# Altium schematic sheet Top.SchDoc: ESCBackerBoard_TOP
size Letter; Author: William Peyton; Organization: Colorado School of Mines; Address1: 1500 Illinois St.; Address2: Golden; Address3: CO 80401; Address4: USA; DocumentNumber: 0000; Revision: V1.0; SheetNumber: 1; SheetTotal: 2
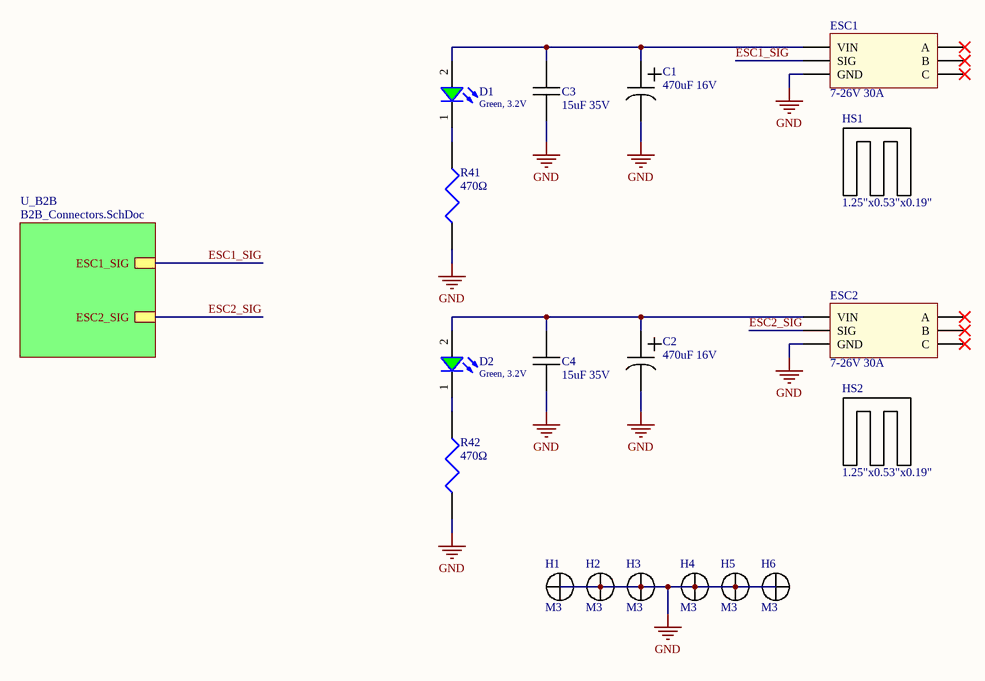
[diagram p0: Top.SchDoc]

## Parts
C1  470uF 16V  [875115357006]
C2  470uF 16V  [875115357006]
C3  15uF 35V  [C2012M Generic]
C4  15uF 35V  [C2012M Generic]
D1  Green, 3.2V  [WL-SMCW_1206]
D2  Green, 3.2V  [WL-SMCW_1206]
ESC1  7-26V 30A  [BasicESC]
ESC2  7-26V 30A  [BasicESC]
H1  M3  [M3_MOUNTING_HOLE]
H2  M3  [M3_MOUNTING_HOLE]
H3  M3  [M3_MOUNTING_HOLE]
H4  M3  [M3_MOUNTING_HOLE]
H5  M3  [M3_MOUNTING_HOLE]
H6  M3  [M3_MOUNTING_HOLE]
HS1  1.25"x0.53"x0.19"  [508500B00000G]
HS2  1.25"x0.53"x0.19"  [508500B00000G]
R41  470Ω  [RMCF1206]
R42  470Ω  [RMCF1206]

## Sub-sheets
U_B2B = B2B_Connectors.SchDoc: ESC2_SIG, ESC1_SIG

## Nets
GND: C1.2 C2.2 C3.2 C4.2 ESC1.GND ESC2.GND H1.1 H2.1 H3.1 H4.1 H5.1 H6.1 R41.1 R42.1
ESC1_SIG: ESC1.SIG ; sheet U_B2B/ESC1_SIG
ESC2_SIG: ESC2.SIG ; sheet U_B2B/ESC2_SIG
NetC1_1: C1.1 C3.1 D1.2(A) ESC1.VIN
NetC2_1: C2.1 C4.1 D2.2(A) ESC2.VIN
NetD1_1: D1.1(K) R41.2
NetD2_1: D2.1(K) R42.2

Not connected (* = marked no-connect by the designer): ESC1 A* B* C*; ESC2 A* B* C*

## Notes on the sheet
- Title
- Size:
- Date:
- Letter
- Number:
- Time:
- Revision:
- Sheet
- of
- File:

## Library data of the parts
C1 C2 = 875115357006: Wurth CAP ALUM POLY 470UF 20% 16V SMD; Manufacturer: Würth Elektronik; ComponentLink1Description: DigiKey; ComponentLink1URL: https://www.digikey.com/en/products/detail/w%C3%BCrth-elektronik/875115357006/5147625?s=N4IgTCBcDaIBwHYCsBGFSDMSEAYcDYQBdAXyA; Part Number: 875115357006; Value: 470uF 16V
C3 C4 = C2012X5R1V156M125AC: TDK CAP CER 15UF 35V X5R 0805; Manufacturer: TDK Corporation; Part Number: C2012X5R1V156M125AC; Value: 15uF 35V; ComponentLink1Description: New link; ComponentLink1URL: *
D1 D2 = 150120GS75000: WL-SMCW SMT Mono-color Chip LED Waterclear, size 1206, Green, 3.2V, 140deg; Chip Technology: InGaN; Dominant Wavelength typ.: 525nm; Luminous Intensity typ.: 450mcd; Peak Wavelength typ.: 515nm; Viewing Angle: 140deg; ComponentLink1Description: Manufacturer; ComponentLink1URL: http://www.we-online.de; ComponentLink2URL: https://www.we-online.com/catalog/datasheet/150120GS75000.pdf; ComponentLink2Description: Datasheet; Forward Voltage typ.: 3.2V; Emitting Color: Green; Mounting Technology: SMT; Operating Temperature: -40 to +85degC; Published Date: December 2019; Part Number: 150120GS75000; Packaging: Tape and Reel; Size: 1206; Publisher: Wurth Elektronik
ESC1 ESC2 = BasicESC: Blue Robotics BasicESC; Manufacturer: Blue Robotics; Part Number: *; Value: 7-26V 30A; ComponentLink1Description: Blue Robotics; ComponentLink1URL: https://bluerobotics.com/store/thrusters/speed-controllers/besc30-r3/
H1-H6 = M3_Mounting_Hole: MECHANICAL M3 Mounting Hole
HS1 HS2 = 508500B00000G: AAVID HEATSINK 24-PIN DIP GLUE-ON BLK; Manufacturer: Aavid, Thermal Division of Boyd Corporation; Part Number: 508500B00000G; Value: 1.25"x0.53"x0.19"; ComponentLink1Description: DigiKey; ComponentLink1URL: https://www.digikey.com/en/products/detail/aavid-thermal-division-of-boyd-corporation/508500B00000G/373762
R41 R42 = RMCF1206JT470R: Stackpole RES 470 OHM 5% 1/4W 1206; Manufacturer: Stackpole Electronics Inc; Part Number: RMCF1206JT470R; Value: 470Ω; ComponentLink1Description: DigiKey; ComponentLink1URL: https://www.digikey.com/en/products/detail/stackpole-electronics-inc/RMCF1206JT470R/1753845